# Altium project PR003.PrjPcb (part 8 of 11)

## Sheet LevelShifters_GPIOs.SchDoc
size A3; SheetNumber: 11; SheetTotal: 16
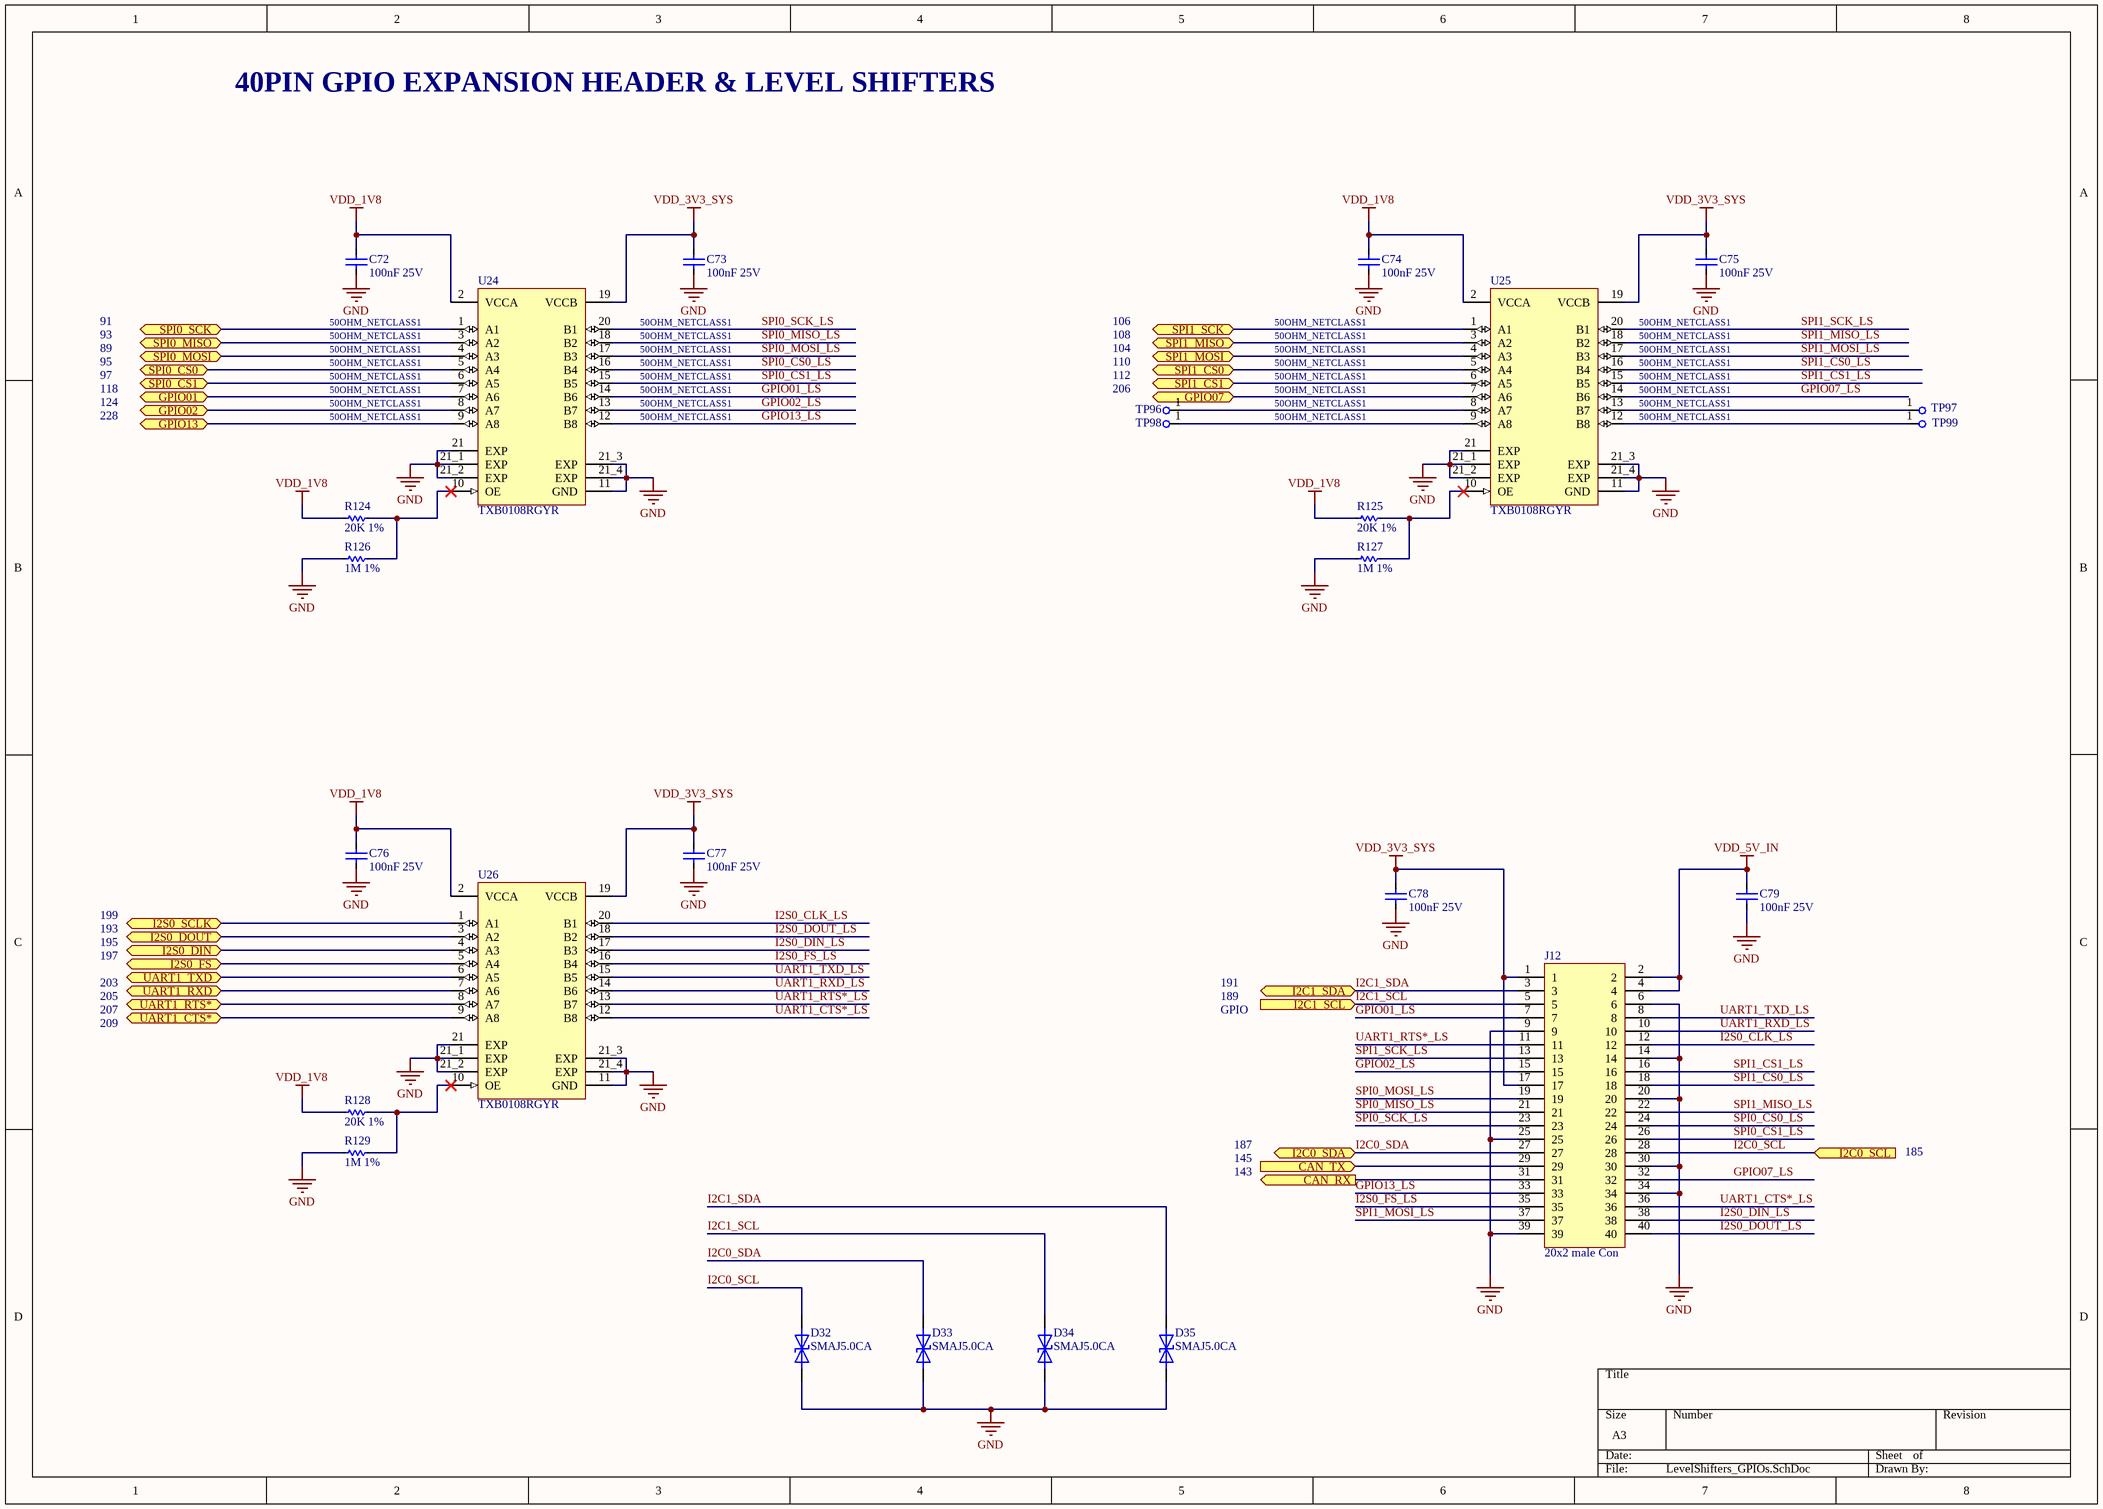
[diagram p10: LevelShifters_GPIOs.SchDoc]

### Parts
C72  100nF 25V  [C0402]
C73  100nF 25V  [C0402]
C74  100nF 25V  [C0402]
C75  100nF 25V  [C0402]
C76  100nF 25V  [C0402]
C77  100nF 25V  [C0402]
C78  100nF 25V  [C0402]
C79  100nF 25V  [C0402]
D32  SMAJ5.0CA  [DO-214AC]
D33  SMAJ5.0CA  [DO-214AC]
D34  SMAJ5.0CA  [DO-214AC]
D35  SMAJ5.0CA  [DO-214AC]
J12  20x2 male Con  [70246-4001]
R124  20K 1%  [R0402]
R125  20K 1%  [R0402]
R126  1M 1%  [R0402]
R127  1M 1%  [R0402]
R128  20K 1%  [R0402]
R129  1M 1%  [R0402]
TP96  (no value)  [TestPoint_Pad_D1.0mm]
TP97  TestPoint  [TestPoint_Pad_D1.0mm]  (value not drawn)
TP98  TestPoint  [TestPoint_Pad_D1.0mm]  (value not drawn)
TP99  TestPoint  [TestPoint_Pad_D1.0mm]  (value not drawn)
U24  TXB0108RGYR  [VQFN-20]
U25  TXB0108RGYR  [VQFN-20]
U26  TXB0108RGYR  [VQFN-20]

### Ports
CAN_RX (out), CAN_TX (in), GPIO01 (bidir), GPIO02 (bidir), GPIO07 (bidir), GPIO13 (bidir), I2C0_SCL (in), I2C0_SDA (bidir), I2C1_SCL (in), I2C1_SDA (bidir), I2S0_DIN (bidir), I2S0_DOUT (bidir), I2S0_FS (bidir), I2S0_SCLK (bidir), SPI0_CS0 (bidir), SPI0_CS1 (bidir), SPI0_MISO (bidir), SPI0_MOSI (bidir), SPI0_SCK (bidir), SPI1_CS0 (bidir), SPI1_CS1 (bidir), SPI1_MISO (bidir), SPI1_MOSI (bidir), SPI1_SCK (bidir), UART1_CTS* (bidir), UART1_RTS* (bidir), UART1_RXD (bidir), UART1_TXD (bidir)

### Nets
GND: C72.1 C73.1 C74.1 C75.1 C76.1 C77.1 C78.1 C79.1 D32.C D33.C D34.C D35.C J12.6 J12.9 J12.14 J12.20 J12.25 J12.30 J12.34 J12.39 R126.1 R127.1 R129.1 U24.11(GND) U24.21(EXP) U24.21_1(EXP) U24.21_2(EXP) U24.21_3(EXP) U24.21_4(EXP) U25.11(GND) U25.21(EXP) U25.21_1(EXP) U25.21_2(EXP) U25.21_3(EXP) U25.21_4(EXP) U26.11(GND) U26.21(EXP) U26.21_1(EXP) U26.21_2(EXP) U26.21_3(EXP) U26.21_4(EXP)
VDD_1V8: C72.2 C74.2 C76.2 R124.1 R125.1 R128.1 U24.2(VCCA) U25.2(VCCA) U26.2(VCCA)
VDD_3V3_SYS: C73.2 C75.2 C77.2 C78.2 J12.1 J12.17 U24.19(VCCB) U25.19(VCCB) U26.19(VCCB)
VDD_5V_IN: C79.2 J12.2 J12.4
GPIO01_LS: J12.7 U24.14(B6)
GPIO02_LS: J12.15 U24.13(B7)
GPIO07_LS: J12.32 U25.14(B6)
GPIO13_LS: J12.33 U24.12(B8)
I2C0_SCL: D32.A J12.28 ; port I2C0_SCL
I2C0_SDA: D33.A J12.27 ; port I2C0_SDA
I2C1_SCL: D34.A J12.5 ; port I2C1_SCL
I2C1_SDA: D35.A J12.3 ; port I2C1_SDA
I2S0_CLK_LS: J12.12 U26.20(B1)
I2S0_DIN_LS: J12.38 U26.17(B3)
I2S0_DOUT_LS: J12.40 U26.18(B2)
I2S0_FS_LS: J12.35 U26.16(B4)
SPI0_CS0_LS: J12.24 U24.16(B4)
SPI0_CS1_LS: J12.26 U24.15(B5)
SPI0_MISO_LS: J12.21 U24.18(B2)
SPI0_MOSI_LS: J12.19 U24.17(B3)
SPI0_SCK_LS: J12.23 U24.20(B1)
SPI1_CS0_LS: J12.18 U25.16(B4)
SPI1_CS1_LS: J12.16 U25.15(B5)
SPI1_MISO_LS: J12.22 U25.18(B2)
SPI1_MOSI_LS: J12.37 U25.17(B3)
SPI1_SCK_LS: J12.13 U25.20(B1)
UART1_CTS*_LS: J12.36 U26.12(B8)
UART1_RTS*_LS: J12.11 U26.13(B7)
UART1_RXD_LS: J12.10 U26.14(B6)
UART1_TXD_LS: J12.8 U26.15(B5)
NetJ10_89: U24.4(A3) ; port SPI0_MOSI
NetJ10_91: U24.1(A1) ; port SPI0_SCK
NetJ10_93: U24.3(A2) ; port SPI0_MISO
NetJ10_95: U24.5(A4) ; port SPI0_CS0
NetJ10_97: U24.6(A5) ; port SPI0_CS1
NetJ10_104: U25.4(A3) ; port SPI1_MOSI
NetJ10_106: U25.1(A1) ; port SPI1_SCK
NetJ10_108: U25.3(A2) ; port SPI1_MISO
NetJ10_110: U25.5(A4) ; port SPI1_CS0
NetJ10_112: U25.6(A5) ; port SPI1_CS1
NetJ10_118: U24.7(A6) ; port GPIO01
NetJ10_124: U24.8(A7) ; port GPIO02
NetJ10_143: J12.31 ; port CAN_RX
NetJ10_145: J12.29 ; port CAN_TX
NetJ10_193: U26.3(A2) ; port I2S0_DOUT
NetJ10_195: U26.4(A3) ; port I2S0_DIN
NetJ10_197: U26.5(A4) ; port I2S0_FS
NetJ10_199: U26.1(A1) ; port I2S0_SCLK
NetJ10_203: U26.6(A5) ; port UART1_TXD
NetJ10_205: U26.7(A6) ; port UART1_RXD
NetJ10_206: U25.7(A6) ; port GPIO07
NetJ10_207: U26.8(A7) ; port UART1_RTS*
NetJ10_209: U26.9(A8) ; port UART1_CTS*
NetJ10_228: U24.9(A8) ; port GPIO13
NetR124_2: R124.2 R126.2 U24.10(OE)
NetR125_2: R125.2 R127.2 U25.10(OE)
NetR128_2: R128.2 R129.2 U26.10(OE)
NetTP96_1: TP96.1 U25.8(A7)
NetTP97_1: TP97.1 U25.13(B7)
NetTP98_1: TP98.1 U25.9(A8)
NetTP99_1: TP99.1 U25.12(B8)

### Notes on the sheet
- 40PIN GPIO EXPANSION HEADER & LEVEL SHIFTERS
- 91
- 93
- 89
- 95
- 97
- 50OHM_NETCLASS1
- 106
- 108
- 104
- 110
- 112
- (near U25) 50OHM_NETCLASS1
- 118
- 124
- 228
- 206
- 199
- 203
- 193
- 195
- 197
- 191
- 205
- 207
- 209
- 189
- GPIO
- 187
- 145
- 143
- 185

### Library data of the parts
C72-C79 = TMK105BJ104KV-F: as C39 on sheet HDMI_Connector; Supplier 1: Digi-Key; Manufacturer Part Number: TMK105BJ104KV-F; RoHS: Yes; Category: Ceramic Capacitors; Stock 1: 11997960; Pricing 1: 1=0.10000, 10=0.03700, 50=0.02000, 100=0.01630, 500=0.01166, 1000=0.00917, 2500=0.00833, 5000=0.00767 (USD); Mount: Surface Mount; Case/Package: 0402; Number of Pins: 2; Case Code (Imperial): 0402; Case Code (Metric): 1005; Weight: 2.3E-05oz; Min Operating Temperature: -55°C; Max Operating Temperature: 85°C; Capacitance: 100nF; Packaging: Tape and Reel; Dielectric: X5R; Voltage Rating (DC): 25V; Voltage Rating: 25V; Package Quantity: 1; Termination: SMD/SMT; Resistor Type: Ceramic; Voltage: 25V; Series: M; Construction: Flat; Length: 1mm; Width: 0.02inch; Height: 0.5mm; Depth: 0.5mm; Thickness: 0.022inch; Reach SVHC Compliant: Yes; Lead Free: Lead Free; Halogen Free: Halogen Free; RoHS Compliant: Yes; Supplier Part Number 1: 587-1456-1-ND
D32-D35 = SMAJ5.0CA: as D11 on sheet HDMI_Connector; Supplier 1: Digi-Key; Manufacturer Part Number: SMAJ5.0CA; RoHS: Yes; Category: TVS Diodes; Stock 1: 526420; Pricing 1: 1=0.43000, 10=0.32000, 100=0.19950, 500=0.13650, 1000=0.10500, 2000=0.09450 (USD); Mount: Surface Mount; Case/Package: DO-214AC; Number of Pins: 2; Min Operating Temperature: -65°C; Max Operating Temperature: 150°C; Package Quantity: 5000; Direction: Bidirectional; Packaging: Tape and Reel; Number of Bidirectional Channels: 1; Reverse Standoff Voltage: 5V; Min Breakdown Voltage: 6.4V; Breakdown Voltage: 6.4V; Number of Channels: 1; Polarity: Bidirectional; Termination: SMD/SMT; Peak Pulse Current: 43.5A; Power Dissipation: 400W; Voltage Rating (DC): 5V; Max Output Current: 43.5A; Resistor Type: Zener; Series: SMAJ; Clamping Voltage-Max: 9.2V; Length: 4.5mm; Width: 2.79mm; Height: 2.087mm; Radiation Hardening: No; Reach SVHC Compliant: Yes; Lead Free: Lead Free; RoHS Compliant: Yes; ComponentLink1URL: https://datasheet.ciiva.com/25624/0900766b810f4edb-25624837.pdf?src-supplier=Rs; ComponentLink1Description: https://datasheet.ciiva.com/25624/0900766b810f4edb-25624837.pdf?src-supplier=Rs; ComponentLink2URL: https://datasheet.ciiva.com/28473/607617-28473438.pdf?src-supplier=Element14; ComponentLink2Description: https://datasheet.ciiva.com/28473/607617-28473438.pdf?src-supplier=Element14; ComponentLink3URL: https://datasheet.ciiva.com/16206/littelfuse-tvs-diode-smaj-16206104.pdf?src-supplier=Future+Electronics; ComponentLink3Description: https://datasheet.ciiva.com/16206/littelfuse-tvs-diode-smaj-16206104.pdf?src-supplier=Future+Electronics; ComponentLink4URL: https://datasheet.ciiva.com/331/littelfuse-tvs-diode-smaj-datasheet-pdf-331055.pdf?src-supplier=Digi-Key; ComponentLink4Description: https://datasheet.ciiva.com/331/littelfuse-tvs-diode-smaj-datasheet-pdf-331055.pdf?src-supplier=Digi-Key; ComponentLink5URL: https://datasheet.ciiva.com/331/littelfuse-tvs-diode-smaj-datasheet-pdf-331056.pdf?src-supplier=Digi-Key; ComponentLink5Description: https://datasheet.ciiva.com/331/littelfuse-tvs-diode-smaj-datasheet-pdf-331056.pdf?src-supplier=Digi-Key; ComponentLink6URL: https://datasheet.ciiva.com/331/littelfuse-tvs-diode-smaj-datasheet-pdf-331054.pdf?src-supplier=Digi-Key; ComponentLink6Description: https://datasheet.ciiva.com/331/littelfuse-tvs-diode-smaj-datasheet-pdf-331054.pdf?src-supplier=Digi-Key; Supplier Part Number 1: SMAJ5.0CALFCT-ND
J12 = 0702464001: Conn Shrouded Header (4 Sides) HDR 40 POS 2.54mm Solder ST Thru-Hole C-Grid® Frame; Manufacturer: Molex; Supplier 1: Digi-Key; Manufacturer Part Number: 0702464001; RoHS: Yes; Category: Uncategorized; Stock 1: 9741; Pricing 1: 1=4.29000, 10=3.77400, 400=3.00210, 1200=2.48745 (USD); ComponentLink1URL: https://datasheet.ciiva.com/6814/702461001-sd-6814000.pdf?src-supplier=Digi-Key; ComponentLink1Description: https://datasheet.ciiva.com/6814/702461001-sd-6814000.pdf?src-supplier=Digi-Key; Supplier Part Number 1: WM6550-ND
R124 R125 R128 = AC0402FR-0720KL: Res Thick Film 0402 20K Ohm 1% 0.063W(1/16W) ±100ppm/C Pad SMD Automotive T/R; Manufacturer: Yageo; Power Rating: 62.5mW; Resistance: 20kR; Voltage Rating: 50V; Max Power Dissipation: 63mW; Temperature Coefficient: 100ppm/°C; Supplier 1: Digi-Key; Manufacturer Part Number: AC0402FR-0720KL; RoHS: Yes; Category: Chip SMD Resistors; Stock 1: 682198; Pricing 1: 1=0.10000, 10=0.01900, 100=0.00790, 1000=0.00353, 2500=0.00307, 5000=0.00253 (USD); Case/Package: 0402; Case Code (Imperial): 0402; Case Code (Metric): 1005; Min Operating Temperature: -55°C; Max Operating Temperature: 155°C; Packaging: Tape and Reel; Tolerance: 1%; Resistor Type: Thick Film; Number of Terminations: 2; Termination: SMD/SMT; Features: Moisture Resistant,Automotive AEC-Q200; Series: AC; Length: 0.039inch; Width: 0.02inch; Height: 0.015inch; RoHS Compliant: Yes; ComponentLink1URL: http://www.mouser.com/ds/2/447/yageodocoutput-1111992.pdf?src-supplier=Mouser; ComponentLink1Description: http://www.mouser.com/ds/2/447/yageodocoutput-1111992.pdf?src-supplier=Mouser; ComponentLink2URL: http://www.yageo.com/NewPortal/yageodocoutput?fileName=/pdf/R-Chip/PYu-AC_51_RoHS_L_6.pdf&src-supplier=Digi-Key; ComponentLink2Description: http://www.yageo.com/NewPortal/yageodocoutput?fileName=/pdf/R-Chip/PYu-AC_51_RoHS_L_6.pdf&src-supplier=Digi-Key; Supplier Part Number 1: YAG3454CT-ND
R126 R127 R129 = AC0402FR-071ML: as R102 on sheet Audio_CodeC; Supplier 1: Digi-Key; Manufacturer Part Number: AC0402FR-071ML; RoHS: Yes; Category: Chip SMD Resistors; Stock 1: 684587; Pricing 1: 1=0.10000, 10=0.01900, 100=0.00790, 1000=0.00353, 2500=0.00307, 5000=0.00253 (USD); Case/Package: 0402; Case Code (Imperial): 0402; Case Code (Metric): 1005; Size Code: 0402; Min Operating Temperature: -55°C; Max Operating Temperature: 155°C; Packaging: Tape and Reel; Tolerance: 1%; Termination: SMD/SMT; Resistor Type: Thick Film; Number of Terminations: 2; Features: Moisture Resistant,Automotive AEC-Q200; Series: AC; Construction: Rectangular; Length: 1mm; Width: 0.5mm; Height: 0.015inch; Depth: 0.5mm; Military Standard: Not; Lead Free: Lead Free; RoHS Compliant: Yes; ComponentLink1URL: http://www.yageo.com/documents/recent/PYu-AC_51_RoHS_L_2.pdf?src-supplier=Mouser; ComponentLink1Description: http://www.yageo.com/documents/recent/PYu-AC_51_RoHS_L_2.pdf?src-supplier=Mouser; ComponentLink2URL: http://www.yageo.com/documents/recent/PYu-AC_51_RoHS_L_2_revised.pdf?src-supplier=Future+Electronics; ComponentLink2Description: http://www.yageo.com/documents/recent/PYu-AC_51_RoHS_L_2_revised.pdf?src-supplier=Future+Electronics; ComponentLink3URL: http://www.yageo.com/NewPortal/yageodocoutput?fileName=/pdf/R-Chip/PYu-AC_51_RoHS_L_6.pdf&src-supplier=Digi-Key; ComponentLink3Description: http://www.yageo.com/NewPortal/yageodocoutput?fileName=/pdf/R-Chip/PYu-AC_51_RoHS_L_6.pdf&src-supplier=Digi-Key; Supplier Part Number 1: YAG3450CT-ND
TP96-TP99 = TestPoint_D1mm
U24-U26 = TXB0108RGYR: IC 8-BIT TRNSLTR 15KV ESD 20VQFN; Manufacturer: Texas Instruments; Data Rate: 100Mbps; Number of Channels: 8; Propagation Delay: 9.5ns; Max Supply Voltage: 5.5V; Min Supply Voltage: 1.2V; Logic Function: Translator; Turn-On Delay Time: 35.6ns; Low Level Output Current: 20uA; High Level Output Current: -20uA; Quiescent Current: 3.5uA; Output Type: 3-STATE; Rise Time: 0.8ns; Nominal Supply Current: 10uA; Channel Type: Bidirectional; Number of Circuits: 1; Supplier 1: Mouser; Manufacturer Part Number: TXB0108RGYR; RoHS: Yes; Category: Voltage Level Shifters; Stock 1: 23719; Pricing 1: 1=1.63000, 10=1.46000, 50=1.38000, 100=1.18000, 1000=0.80200, 10000=0.80100 (USD); Mount: Surface Mount; Case/Package: VQFN EP; Number of Pins: 20; Weight: 0.001517oz; Contact Plating: Gold; Min Operating Temperature: -40°C; Max Operating Temperature: 85°C; Package Quantity: 3000; Packaging: Tape and Reel; Number of Bits: 8; Output Current: 20uA; Series: -; Number of Inputs: 8; Termination: SMD/SMT; Supply Current: 10uA; Length: 4.5mm; Width: 3.5mm; Height: 0.8mm; Radiation Hardening: No; Lead Free: Lead Free; RoHS Compliant: Yes; Reach SVHC Compliant: Yes; ComponentLink1URL: https://datasheet.ciiva.com/15096/getdatasheetpartid-172984-15096214.pdf?src-supplier=Verical; ComponentLink1Description: https://datasheet.ciiva.com/15096/getdatasheetpartid-172984-15096214.pdf?src-supplier=Verical; ComponentLink2URL: https://datasheet.ciiva.com/1508/1811182-1508728.pdf?src-supplier=Element14; ComponentLink2Description: https://datasheet.ciiva.com/1508/1811182-1508728.pdf?src-supplier=Element14; ComponentLink3URL: https://datasheet.ciiva.com/1899/txb0108-1899602.pdf?src-supplier=Digi-Key; ComponentLink3Description: https://datasheet.ciiva.com/1899/txb0108-1899602.pdf?src-supplier=Digi-Key; ComponentLink4URL: https://datasheet.ciiva.com/1899/txb0108-1899601.pdf?src-supplier=Digi-Key; ComponentLink4Description: https://datasheet.ciiva.com/1899/txb0108-1899601.pdf?src-supplier=Digi-Key; ComponentLink5URL: https://datasheet.ciiva.com/1899/txb0108-1899603.pdf?src-supplier=Digi-Key; ComponentLink5Description: https://datasheet.ciiva.com/1899/txb0108-1899603.pdf?src-supplier=Digi-Key; Supplier Part Number 1: 595-TXB0108RGYR

## Sheet SoC_Fan_Header.SchDoc
size A3; SheetNumber: 14; SheetTotal: 16
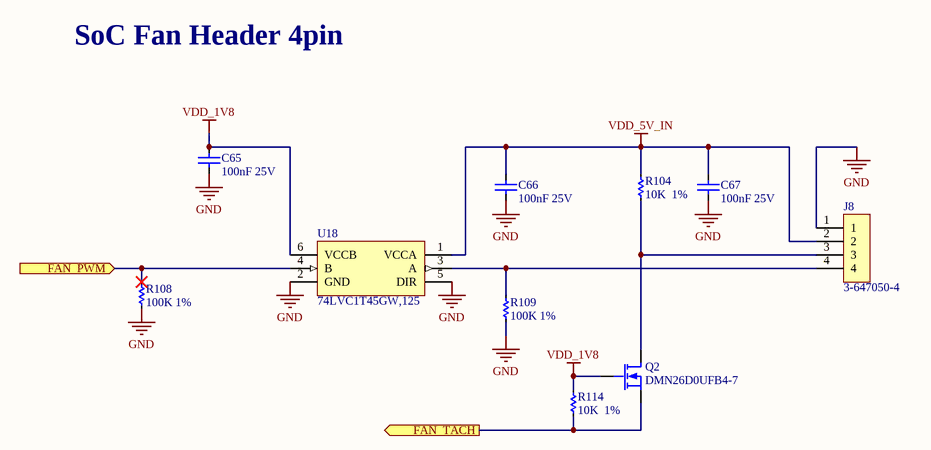
[diagram p11: SoC_Fan_Header.SchDoc]

### Parts
C65  100nF 25V  [C0402]
C66  100nF 25V  [C0402]
C67  100nF 25V  [C0402]
J8  3-647050-4  [3-647050-4]
Q2  DMN26D0UFB4-7  [DFN1006-3]
R104  10K  1%  [R0402]
R108  100K 1%  [R0402]
R109  100K 1%  [R0402]
R114  10K  1%  [R0402]
U18  74LVC1T45GW,125  [SOT-363]

### Ports
FAN_PWM (in), FAN_TACH (out)

### Nets
GND: C65.1 C66.1 C67.1 J8.1 R108.1 R109.1 U18.2(GND) U18.5(DIR)
VDD_1V8: C65.2 Q2.1(G) R114.2 U18.6(VCCB)
VDD_5V_IN: C66.2 C67.2 J8.2 R104.2 U18.1(VCCA)
NetJ8_3: J8.3 Q2.3(D) R104.1
NetJ8_4: J8.4 R109.2 U18.3(A)
NetJ10_208: Q2.2(S) R114.1 ; port FAN_TACH
NetJ10_230: R108.2 U18.4(B) ; port FAN_PWM

### Notes on the sheet
- SoC Fan Header 4pin

### Library data of the parts
C65-C67 = TMK105BJ104KV-F: as C39 on sheet HDMI_Connector; Supplier 1: Digi-Key; Manufacturer Part Number: TMK105BJ104KV-F; RoHS: Yes; Category: Ceramic Capacitors; Stock 1: 11997960; Pricing 1: 1=0.10000, 10=0.03700, 50=0.02000, 100=0.01630, 500=0.01166, 1000=0.00917, 2500=0.00833, 5000=0.00767 (USD); Mount: Surface Mount; Case/Package: 0402; Number of Pins: 2; Case Code (Imperial): 0402; Case Code (Metric): 1005; Weight: 2.3E-05oz; Min Operating Temperature: -55°C; Max Operating Temperature: 85°C; Capacitance: 100nF; Packaging: Tape and Reel; Dielectric: X5R; Voltage Rating (DC): 25V; Voltage Rating: 25V; Package Quantity: 1; Termination: SMD/SMT; Resistor Type: Ceramic; Voltage: 25V; Series: M; Construction: Flat; Length: 1mm; Width: 0.02inch; Height: 0.5mm; Depth: 0.5mm; Thickness: 0.022inch; Reach SVHC Compliant: Yes; Lead Free: Lead Free; Halogen Free: Halogen Free; RoHS Compliant: Yes; Supplier Part Number 1: 587-1456-1-ND
J8 = 3-647050-4: Header Assembly 4 Position MTA100 F/L HITEMP MTA-100 Series; Manufacturer: TE Connectivity; Supplier 1: Digi-Key; Manufacturer Part Number: 3-647050-4; RoHS: Yes; Category: Uncategorized; Stock 1: 12221; Pricing 1: 1=2.60000, 10=2.26400, 100=2.02290, 500=1.68574, 1000=1.44492, 5000=1.28116 (USD); ComponentLink1URL: https://datasheet.ciiva.com/717/eng-cd-647050-t-647050-c-drw-717307.pdf?src-supplier=Digi-Key; ComponentLink1Description: https://datasheet.ciiva.com/717/eng-cd-647050-t-647050-c-drw-717307.pdf?src-supplier=Digi-Key; ComponentLink2URL: https://datasheet.ciiva.com/30190/8852eng-ds-82056-mta-0608-30190425.pdf?src-supplier=Onlinecomponents.com; ComponentLink2Description: https://datasheet.ciiva.com/30190/8852eng-ds-82056-mta-0608-30190425.pdf?src-supplier=Onlinecomponents.com; Supplier Part Number 1: A122444-ND
Q2 = DMN26D0UFB4-7: as Q4 on sheet HDMI_Connector; Supplier 1: Mouser; Manufacturer Part Number: DMN26D0UFB4-7; RoHS: Yes; Category: MOSFETs; Stock 1: 21043; Pricing 1: 1=0.38000, 10=0.32100, 50=0.32100, 100=0.17000, 1000=0.07700, 10000=0.05000 (USD); Mount: Surface Mount; Case/Package: DFN; Number of Pins: 3; Min Operating Temperature: -55°C; Max Operating Temperature: 150°C; Packaging: Tape and Reel; Package Quantity: 3000; Max Power Dissipation: 350mW; Element Configuration: Single; Number of Channels: 1; Polarity: N-CHANNEL; Series: -; Drain-source On Resistance-Max: 10R; Length: 1.05mm; Width: 0.65mm; Height: 0.35mm; Radiation Hardening: No; Reach SVHC Compliant: Yes; Lead Free: Lead Free; RoHS Compliant: Yes; ComponentLink1URL: https://datasheet.ciiva.com/4443/ds31775-89139-4443083.pdf?src-supplier=Mouser; ComponentLink1Description: https://datasheet.ciiva.com/4443/ds31775-89139-4443083.pdf?src-supplier=Mouser; ComponentLink2URL: https://datasheet.ciiva.com/11176/ds31775-11176556.pdf?src-supplier=Avnet; ComponentLink2Description: https://datasheet.ciiva.com/11176/ds31775-11176556.pdf?src-supplier=Avnet; ComponentLink3URL: https://datasheet.ciiva.com/16434/ds31775-16434037.pdf?src-supplier=Future+Electronics; ComponentLink3Description: https://datasheet.ciiva.com/16434/ds31775-16434037.pdf?src-supplier=Future+Electronics; ComponentLink4URL: https://datasheet.ciiva.com/48532/ds31775-48532486.pdf?src-supplier=Avnet; ComponentLink4Description: https://datasheet.ciiva.com/48532/ds31775-48532486.pdf?src-supplier=Avnet; ComponentLink5URL: https://datasheet.ciiva.com/934/ds31775-934573.pdf?src-supplier=Digi-Key; ComponentLink5Description: https://datasheet.ciiva.com/934/ds31775-934573.pdf?src-supplier=Digi-Key; ComponentLink6URL: https://datasheet.ciiva.com/934/ds31775-934574.pdf?src-supplier=Digi-Key; ComponentLink6Description: https://datasheet.ciiva.com/934/ds31775-934574.pdf?src-supplier=Digi-Key; ComponentLink7URL: https://datasheet.ciiva.com/934/ds31775-934572.pdf?src-supplier=Digi-Key; ComponentLink7Description: https://datasheet.ciiva.com/934/ds31775-934572.pdf?src-supplier=Digi-Key; Supplier Part Number 1: 621-DMN26D0UFB4-7
R104 R114 = RC0402FR-0710KP: as R80 on sheet HDMI_Connector; Supplier 1: Digi-Key; Manufacturer Part Number: RC0402FR-0710KP; RoHS: Yes; Category: Chip SMD Resistors; Stock 1: 1032587; Pricing 1: 1=0.10000, 10=0.03100, 100=0.01280, 1000=0.00573, 2500=0.00497, 5000=0.00411 (USD); Case/Package: 0402; Case Code (Metric): 1005; Case Code (Imperial): 0402; Min Operating Temperature: -55°C; Max Operating Temperature: 155°C; Packaging: Tape and Reel; Resistor Type: Thick Film; Number of Terminations: 2; Tolerance: 1%; Features: Moisture Resistant; Length: 0.039inch; Width: 0.02inch; Height: 0.016inch; RoHS Compliant: Yes; ComponentLink1URL: http://www.yageo.com/NewPortal/yageodocoutput?fileName=/pdf/R-Chip/PYu-RC_51_RoHS_P_0.pdf&src-supplier=Digi-Key; ComponentLink1Description: http://www.yageo.com/NewPortal/yageodocoutput?fileName=/pdf/R-Chip/PYu-RC_51_RoHS_P_0.pdf&src-supplier=Digi-Key; Supplier Part Number 1: YAG1249CT-ND
R108 R109 = RC0402FR-07100KL: as R57 on sheet HDMI_Connector; Supplier 1: Digi-Key; Manufacturer Part Number: RC0402FR-07100KL; RoHS: Yes; Category: Chip SMD Resistors; Stock 1: 41082272; Pricing 1: 1=0.10000, 10=0.01400, 100=0.00580, 1000=0.00262, 2500=0.00228, 5000=0.00188 (USD); Case/Package: 0402; Case Code (Metric): 1005; Case Code (Imperial): 0402; Min Operating Temperature: -55°C; Max Operating Temperature: 155°C; Tolerance: 1%; Package Quantity: 1; Packaging: Tape and Reel; Resistor Type: Thick Film; Number of Terminations: 2; Termination: SMD/SMT; Max Power Dissipation: 63mW; Working Voltage: 50V; Features: Moisture Resistant; Series: RC; Resistance Tolerance: 1%; Construction: Rectangular; Technology: THICK FILM; Length: 0.039inch; Width: 0.02inch; Height: 0.016inch; Depth: 0.5mm; Reach SVHC Compliant: Yes; Military Standard: Not; Lead Free: Lead Free; RoHS Compliant: Yes; ComponentLink1URL: https://datasheet.ciiva.com/11819/0900766b80c66297-11819452.pdf?src-supplier=RSComponents; ComponentLink1Description: https://datasheet.ciiva.com/11819/0900766b80c66297-11819452.pdf?src-supplier=RSComponents; ComponentLink2URL: https://datasheet.ciiva.com/22747/1018594-22747509.pdf?src-supplier=Element14; ComponentLink2Description: https://datasheet.ciiva.com/22747/1018594-22747509.pdf?src-supplier=Element14; ComponentLink3URL: https://datasheet.ciiva.com/2453/pyu-r-int-thick-7-2453362.pdf?src-supplier=Digi-Key; ComponentLink3Description: https://datasheet.ciiva.com/2453/pyu-r-int-thick-7-2453362.pdf?src-supplier=Digi-Key; ComponentLink4URL: https://datasheet.ciiva.com/2453/pyu-r-int-thick-7-2453363.pdf?src-supplier=Digi-Key; ComponentLink4Description: https://datasheet.ciiva.com/2453/pyu-r-int-thick-7-2453363.pdf?src-supplier=Digi-Key; ComponentLink5URL: https://datasheet.ciiva.com/2453/pyu-r-int-thick-7-2453361.pdf?src-supplier=Digi-Key; ComponentLink5Description: https://datasheet.ciiva.com/2453/pyu-r-int-thick-7-2453361.pdf?src-supplier=Digi-Key; ComponentLink6URL: https://datasheet.ciiva.com/12667/pyu-rc0402-51-rohs-l-6-r-12667930.pdf?src-supplier=Mouser; ComponentLink6Description: https://datasheet.ciiva.com/12667/pyu-rc0402-51-rohs-l-6-r-12667930.pdf?src-supplier=Mouser; ComponentLink7URL: https://datasheet.ciiva.com/15189/getdatasheetpartid-323696-15189334.pdf?src-supplier=Verical; ComponentLink7Description: https://datasheet.ciiva.com/15189/getdatasheetpartid-323696-15189334.pdf?src-supplier=Verical; Supplier Part Number 1: 311-100KLRCT-ND
U18 = 74LVC1T45GW,125: TXRX XLATING DUAL 3ST 6TSSOP; Manufacturer: Nexperia; Supplier 1: Mouser; Manufacturer Part Number: 74LVC1T45GW,125; RoHS: Yes; Category: Voltage Level Shifters; Stock 1: 147483; Pricing 1: 1=0.47000, 10=0.37500, 50=0.37500, 100=0.27900, 1000=0.18200, 10000=0.15100 (USD); RoHS Compliant: Yes; ComponentLink1URL: http://www.farnell.com/datasheets/1645592.pdf?src-supplier=Farnell; ComponentLink1Description: http://www.farnell.com/datasheets/1645592.pdf?src-supplier=Farnell; ComponentLink2URL: https://assets.nexperia.com/documents/data-sheet/74LVC_LVCH1T45.pdf?src-supplier=Digi-Key; ComponentLink2Description: https://assets.nexperia.com/documents/data-sheet/74LVC_LVCH1T45.pdf?src-supplier=Digi-Key; Supplier Part Number 1: 771-74LVC1T45GW125

## Sheet Config_UART_OptionalHeader.SchDoc
size A3; SheetNumber: 12; SheetTotal: 16
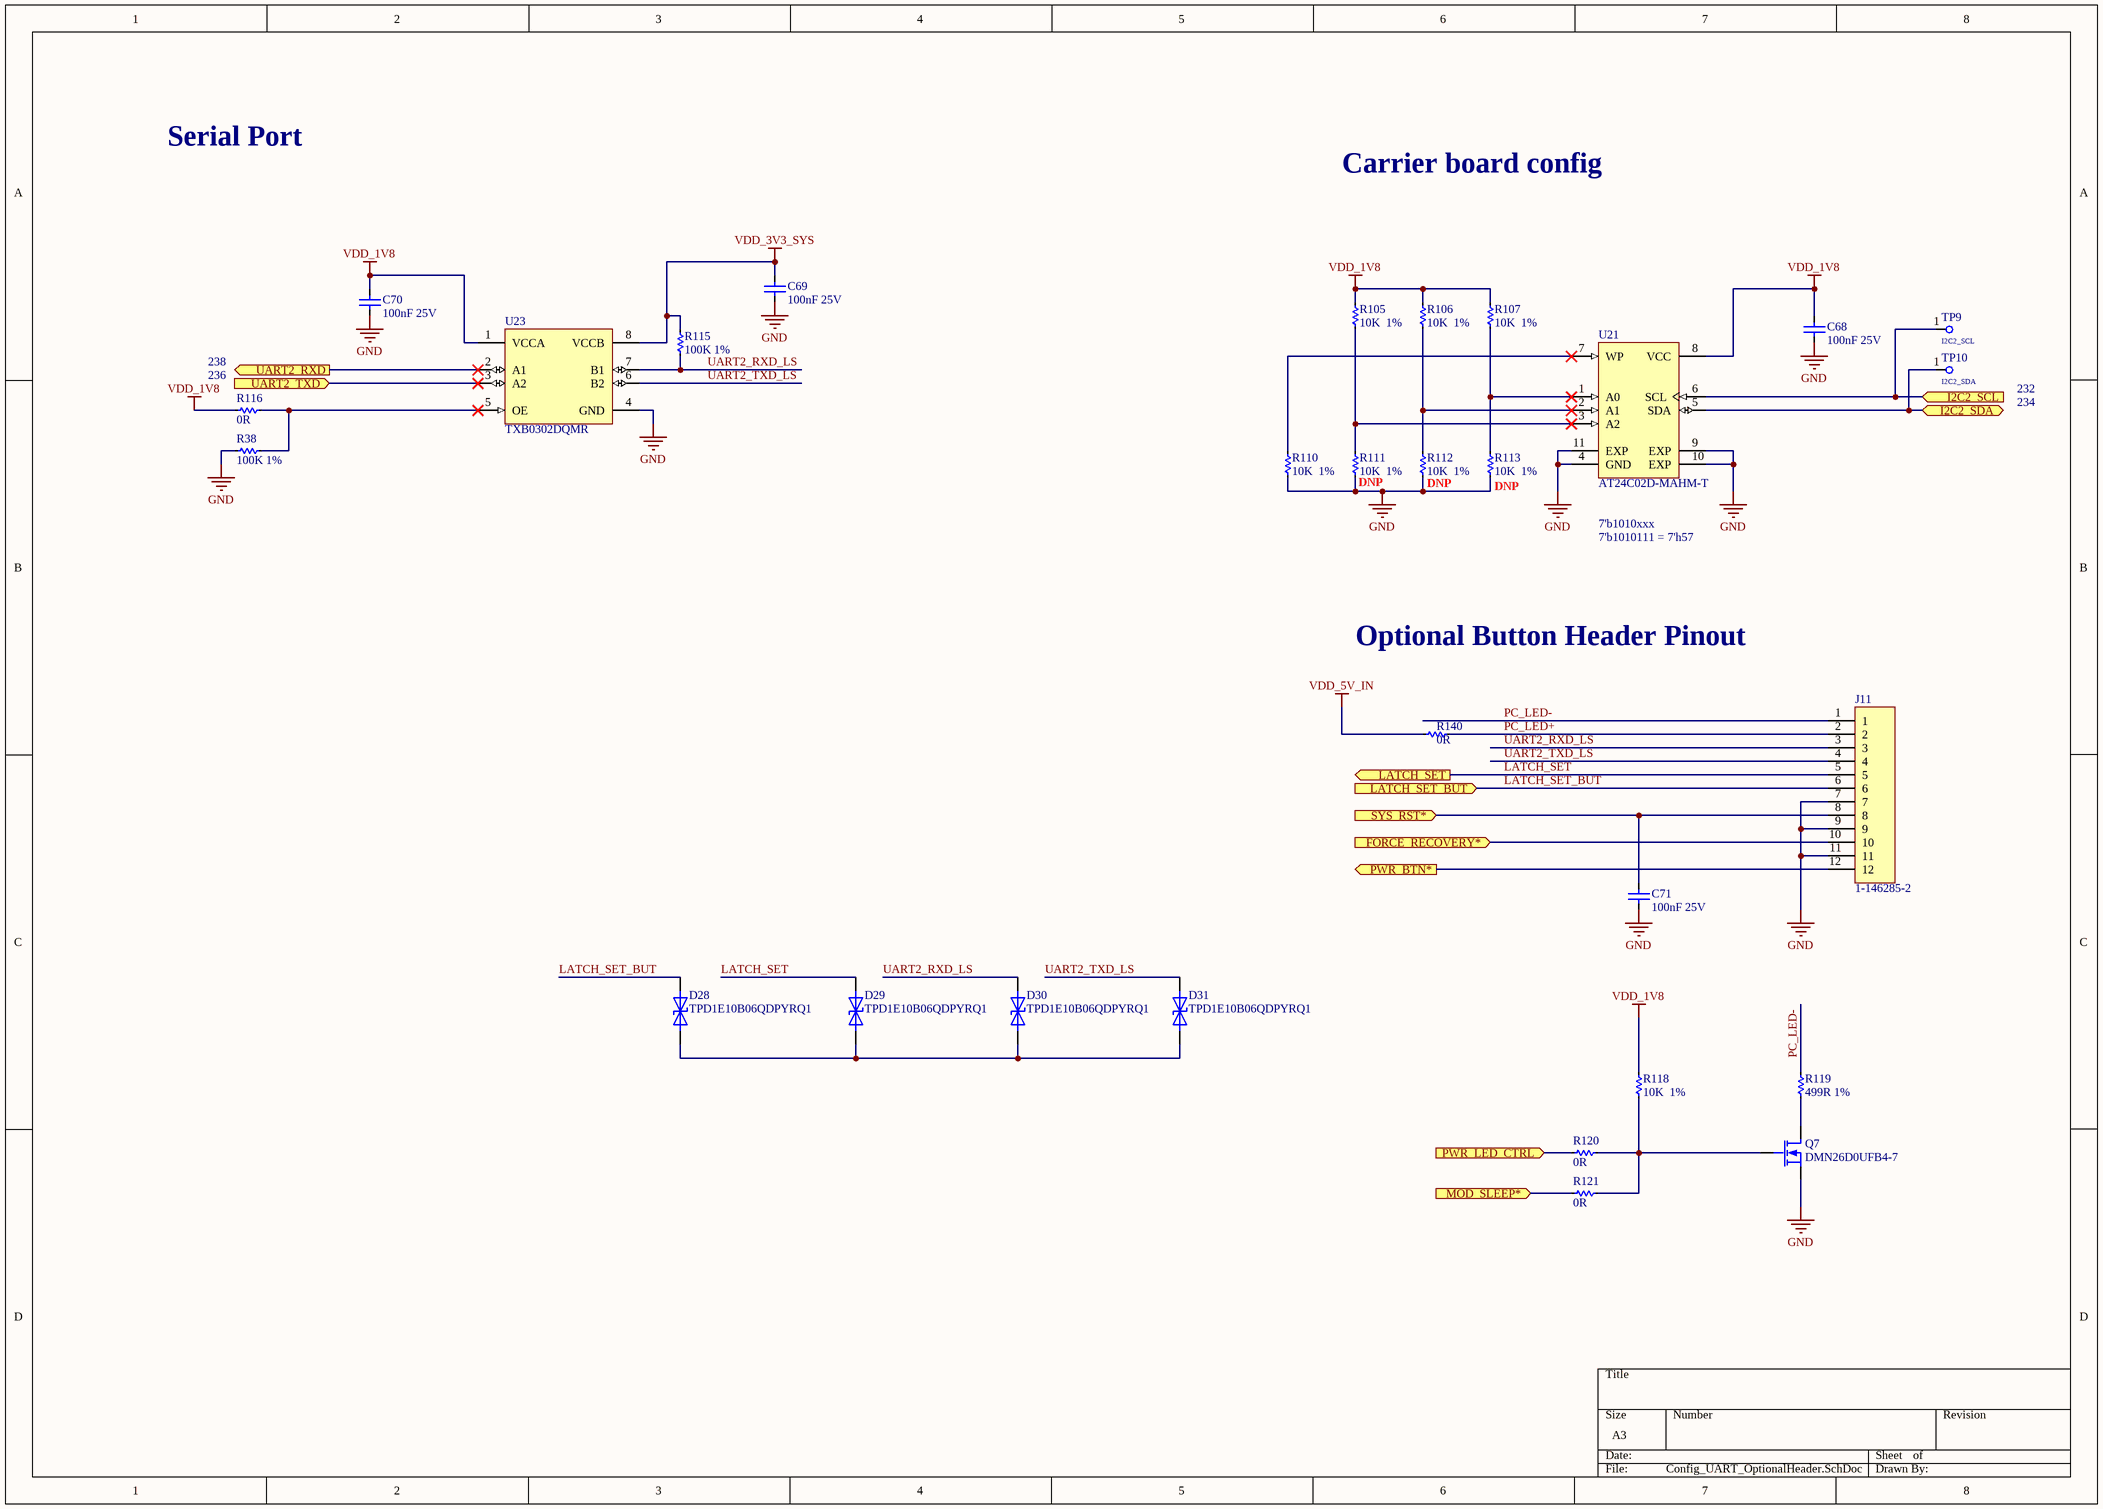
[diagram p12: Config_UART_OptionalHeader.SchDoc]

### Parts
C68  100nF 25V  [C0402]
C69  100nF 25V  [C0402]
C70  100nF 25V  [C0402]
C71  100nF 25V  [C0402]
D28  TPD1E10B06QDPYRQ1  [2-X1SON (1x.60)]
D29  TPD1E10B06QDPYRQ1  [2-X1SON (1x.60)]
D30  TPD1E10B06QDPYRQ1  [2-X1SON (1x.60)]
D31  TPD1E10B06QDPYRQ1  [2-X1SON (1x.60)]
J11  1-146285-2  [1-146285-2]
Q7  DMN26D0UFB4-7  [DFN1006-3]
R38  100K 1%  [R0402]
R105  10K  1%  [R0402]
R106  10K  1%  [R0402]
R107  10K  1%  [R0402]
R110  10K  1%  [R0402]
R111  10K  1%  [R0402]
R112  10K  1%  [R0402]
R113  10K  1%  [R0402]
R115  100K 1%  [R0402]
R116  0R  [R0402]
R118  10K  1%  [R0402]
R119  499R 1%  [R0402]
R120  0R  [R0402]
R121  0R  [R0402]
R140  0R  [R0603]
TP9  I2C2_SCL  [TestPoint_Pad_D1.0mm]
TP10  I2C2_SDA  [TestPoint_Pad_D1.0mm]
U21  AT24C02D-MAHM-T  [UDFN (2x3)-8]
U23  TXB0302DQMR  [8-X2SON (1.8x1.2)]

### Ports
FORCE_RECOVERY* (in), I2C2_SCL (in), I2C2_SDA (bidir), LATCH_SET (out), LATCH_SET_BUT (in), MOD_SLEEP* (in), PWR_BTN* (out), PWR_LED_CTRL (in), SYS_RST* (in), UART2_RXD (out), UART2_TXD (in)

### Nets
GND: C68.1 C69.1 C70.1 C71.1 J11.7 J11.9 J11.11 Q7.2(S) R38.1 R110.1 R111.1 R112.1 R113.1 U21.4(GND) U21.9(EXP) U21.10(EXP) U21.11(EXP) U23.4(GND)
VDD_1V8: C68.2 C70.2 R105.2 R106.2 R107.2 R116.1 R118.2 U21.8(VCC) U23.1(VCCA)
VDD_3V3_SYS: C69.2 R115.2 U23.8(VCCB)
VDD_5V_IN: R140.1
I2C2_SCL: TP9.1 U21.6(SCL) ; port I2C2_SCL
I2C2_SDA: TP10.1 U21.5(SDA) ; port I2C2_SDA
LATCH_SET: D29.2 J11.5 ; port LATCH_SET
LATCH_SET_BUT: D28.2 J11.6 ; port LATCH_SET_BUT
MOD_SLEEP*: R121.1 ; port MOD_SLEEP*
PC_LED+: J11.2 R140.2
PC_LED-: J11.1 R119.2
PWR_BTN*: J11.12 ; port PWR_BTN*
PWR_LED_CTRL: R120.1 ; port PWR_LED_CTRL
SYS_RST*: C71.2 J11.8 ; port SYS_RST*
UART2_RXD_LS: D30.2 J11.3 R115.1 U23.7(B1)
UART2_TXD_LS: D31.2 J11.4 U23.6(B2)
NetD28_1: D28.1 D29.1 D30.1 D31.1
NetD47_2: J11.10 ; port FORCE_RECOVERY*
NetJ10_236: U23.3(A2) ; port UART2_TXD
NetJ10_238: U23.2(A1) ; port UART2_RXD
NetQ7_1: Q7.1(G) R118.1 R120.2 R121.2
NetQ7_3: Q7.3(D) R119.1
NetR38_2: R38.2 R116.2 U23.5(OE)
NetR105_1: R105.1 R111.2 U21.3(A2)
NetR106_1: R106.1 R112.2 U21.2(A1)
NetR107_1: R107.1 R113.2 U21.1(A0)
NetR110_2: R110.2 U21.7(WP)

### Notes on the sheet
- Serial Port
- Carrier board config
- (near R116) 238
- (near R116) 236
- 232
- 234
- (near R111) DNP
- (near R112) DNP
- (near R113) DNP
- 7'b1010xxx
- 7'b1010111 = 7'h57
- Optional Button Header Pinout

### Library data of the parts
C68-C71 = TMK105BJ104KV-F: as C39 on sheet HDMI_Connector; Supplier 1: Digi-Key; Manufacturer Part Number: TMK105BJ104KV-F; RoHS: Yes; Category: Ceramic Capacitors; Stock 1: 11997960; Pricing 1: 1=0.10000, 10=0.03700, 50=0.02000, 100=0.01630, 500=0.01166, 1000=0.00917, 2500=0.00833, 5000=0.00767 (USD); Mount: Surface Mount; Case/Package: 0402; Number of Pins: 2; Case Code (Imperial): 0402; Case Code (Metric): 1005; Weight: 2.3E-05oz; Min Operating Temperature: -55°C; Max Operating Temperature: 85°C; Capacitance: 100nF; Packaging: Tape and Reel; Dielectric: X5R; Voltage Rating (DC): 25V; Voltage Rating: 25V; Package Quantity: 1; Termination: SMD/SMT; Resistor Type: Ceramic; Voltage: 25V; Series: M; Construction: Flat; Length: 1mm; Width: 0.02inch; Height: 0.5mm; Depth: 0.5mm; Thickness: 0.022inch; Reach SVHC Compliant: Yes; Lead Free: Lead Free; Halogen Free: Halogen Free; RoHS Compliant: Yes; Supplier Part Number 1: 587-1456-1-ND
D28-D31 = TPD1E10B06QDPYRQ1: as D9 on sheet HDMI_Connector; Supplier 1: Mouser; Manufacturer Part Number: TPD1E10B06QDPYRQ1; RoHS: Yes; Category: TVS Diodes; Stock 1: 130973; Pricing 1: 1=0.46000, 10=0.34900, 50=0.34900, 100=0.21800, 1000=0.11500, 10000=0.08800 (USD); Case/Package: 0402; Number of Pins: 2; Min Operating Temperature: -40°C; Max Operating Temperature: 125°C; Lead Free: Lead Free; RoHS Compliant: Yes; ComponentLink1URL: http://www.ti.com/lit/ds/symlink/tpd1e10b06-q1.pdf?src-supplier=Digi-Key; ComponentLink1Description: http://www.ti.com/lit/ds/symlink/tpd1e10b06-q1.pdf?src-supplier=Digi-Key; ComponentLink2URL: http://www.ti.com/general/docs/suppproductinfo.tsp?distId=10&amp;gotoUrl=http%3A%2F%2Fwww.ti.com%2Flit%2Fgpn%2Ftpd1e10b06-q1&src-supplier=Digi-Key; ComponentLink2Description: http://www.ti.com/general/docs/suppproductinfo.tsp?distId=10&amp;gotoUrl=http%3A%2F%2Fwww.ti.com%2Flit%2Fgpn%2Ftpd1e10b06-q1&src-supplier=Digi-Key; Supplier Part Number 1: 595-PD1E10B06QDPYRQ1
J11 = 1-146285-2: Conn Unshrouded Header HDR 12 POS 2.54mm Solder ST Thru-Hole Automotive Carton; Manufacturer: TE Connectivity; Supplier 1: Avnet; Manufacturer Part Number: 1-146285-2; RoHS: No; Category: Connectors; ComponentLink1URL: https://datasheet.ciiva.com/9518/eng-ds-1307819-ampmodu-0811-9518222.pdf?src-supplier=Avnet; ComponentLink1Description: https://datasheet.ciiva.com/9518/eng-ds-1307819-ampmodu-0811-9518222.pdf?src-supplier=Avnet; ComponentLink2URL: https://datasheet.ciiva.com/716/eng-cd-146285-h-716787.pdf?src-supplier=Digi-Key; ComponentLink2Description: https://datasheet.ciiva.com/716/eng-cd-146285-h-716787.pdf?src-supplier=Digi-Key; Supplier Part Number 1: 1-146285-2
Q7 = DMN26D0UFB4-7: as Q4 on sheet HDMI_Connector; Supplier 1: Mouser; Manufacturer Part Number: DMN26D0UFB4-7; RoHS: Yes; Category: MOSFETs; Stock 1: 21043; Pricing 1: 1=0.38000, 10=0.32100, 50=0.32100, 100=0.17000, 1000=0.07700, 10000=0.05000 (USD); Mount: Surface Mount; Case/Package: DFN; Number of Pins: 3; Min Operating Temperature: -55°C; Max Operating Temperature: 150°C; Packaging: Tape and Reel; Package Quantity: 3000; Max Power Dissipation: 350mW; Element Configuration: Single; Number of Channels: 1; Polarity: N-CHANNEL; Series: -; Drain-source On Resistance-Max: 10R; Length: 1.05mm; Width: 0.65mm; Height: 0.35mm; Radiation Hardening: No; Reach SVHC Compliant: Yes; Lead Free: Lead Free; RoHS Compliant: Yes; ComponentLink1URL: https://datasheet.ciiva.com/4443/ds31775-89139-4443083.pdf?src-supplier=Mouser; ComponentLink1Description: https://datasheet.ciiva.com/4443/ds31775-89139-4443083.pdf?src-supplier=Mouser; ComponentLink2URL: https://datasheet.ciiva.com/11176/ds31775-11176556.pdf?src-supplier=Avnet; ComponentLink2Description: https://datasheet.ciiva.com/11176/ds31775-11176556.pdf?src-supplier=Avnet; ComponentLink3URL: https://datasheet.ciiva.com/16434/ds31775-16434037.pdf?src-supplier=Future+Electronics; ComponentLink3Description: https://datasheet.ciiva.com/16434/ds31775-16434037.pdf?src-supplier=Future+Electronics; ComponentLink4URL: https://datasheet.ciiva.com/48532/ds31775-48532486.pdf?src-supplier=Avnet; ComponentLink4Description: https://datasheet.ciiva.com/48532/ds31775-48532486.pdf?src-supplier=Avnet; ComponentLink5URL: https://datasheet.ciiva.com/934/ds31775-934573.pdf?src-supplier=Digi-Key; ComponentLink5Description: https://datasheet.ciiva.com/934/ds31775-934573.pdf?src-supplier=Digi-Key; ComponentLink6URL: https://datasheet.ciiva.com/934/ds31775-934574.pdf?src-supplier=Digi-Key; ComponentLink6Description: https://datasheet.ciiva.com/934/ds31775-934574.pdf?src-supplier=Digi-Key; ComponentLink7URL: https://datasheet.ciiva.com/934/ds31775-934572.pdf?src-supplier=Digi-Key; ComponentLink7Description: https://datasheet.ciiva.com/934/ds31775-934572.pdf?src-supplier=Digi-Key; Supplier Part Number 1: 621-DMN26D0UFB4-7
R38 R115 = RC0402FR-07100KL: as R57 on sheet HDMI_Connector; Supplier 1: Digi-Key; Manufacturer Part Number: RC0402FR-07100KL; RoHS: Yes; Category: Chip SMD Resistors; Stock 1: 41082272; Pricing 1: 1=0.10000, 10=0.01400, 100=0.00580, 1000=0.00262, 2500=0.00228, 5000=0.00188 (USD); Case/Package: 0402; Case Code (Metric): 1005; Case Code (Imperial): 0402; Min Operating Temperature: -55°C; Max Operating Temperature: 155°C; Tolerance: 1%; Package Quantity: 1; Packaging: Tape and Reel; Resistor Type: Thick Film; Number of Terminations: 2; Termination: SMD/SMT; Max Power Dissipation: 63mW; Working Voltage: 50V; Features: Moisture Resistant; Series: RC; Resistance Tolerance: 1%; Construction: Rectangular; Technology: THICK FILM; Length: 0.039inch; Width: 0.02inch; Height: 0.016inch; Depth: 0.5mm; Reach SVHC Compliant: Yes; Military Standard: Not; Lead Free: Lead Free; RoHS Compliant: Yes; ComponentLink1URL: https://datasheet.ciiva.com/11819/0900766b80c66297-11819452.pdf?src-supplier=RSComponents; ComponentLink1Description: https://datasheet.ciiva.com/11819/0900766b80c66297-11819452.pdf?src-supplier=RSComponents; ComponentLink2URL: https://datasheet.ciiva.com/22747/1018594-22747509.pdf?src-supplier=Element14; ComponentLink2Description: https://datasheet.ciiva.com/22747/1018594-22747509.pdf?src-supplier=Element14; ComponentLink3URL: https://datasheet.ciiva.com/2453/pyu-r-int-thick-7-2453362.pdf?src-supplier=Digi-Key; ComponentLink3Description: https://datasheet.ciiva.com/2453/pyu-r-int-thick-7-2453362.pdf?src-supplier=Digi-Key; ComponentLink4URL: https://datasheet.ciiva.com/2453/pyu-r-int-thick-7-2453363.pdf?src-supplier=Digi-Key; ComponentLink4Description: https://datasheet.ciiva.com/2453/pyu-r-int-thick-7-2453363.pdf?src-supplier=Digi-Key; ComponentLink5URL: https://datasheet.ciiva.com/2453/pyu-r-int-thick-7-2453361.pdf?src-supplier=Digi-Key; ComponentLink5Description: https://datasheet.ciiva.com/2453/pyu-r-int-thick-7-2453361.pdf?src-supplier=Digi-Key; ComponentLink6URL: https://datasheet.ciiva.com/12667/pyu-rc0402-51-rohs-l-6-r-12667930.pdf?src-supplier=Mouser; ComponentLink6Description: https://datasheet.ciiva.com/12667/pyu-rc0402-51-rohs-l-6-r-12667930.pdf?src-supplier=Mouser; ComponentLink7URL: https://datasheet.ciiva.com/15189/getdatasheetpartid-323696-15189334.pdf?src-supplier=Verical; ComponentLink7Description: https://datasheet.ciiva.com/15189/getdatasheetpartid-323696-15189334.pdf?src-supplier=Verical; Supplier Part Number 1: 311-100KLRCT-ND
R105-R107 R110-R113 R118 = RC0402FR-0710KP: as R80 on sheet HDMI_Connector; Supplier 1: Digi-Key; Manufacturer Part Number: RC0402FR-0710KP; RoHS: Yes; Category: Chip SMD Resistors; Stock 1: 1032587; Pricing 1: 1=0.10000, 10=0.03100, 100=0.01280, 1000=0.00573, 2500=0.00497, 5000=0.00411 (USD); Case/Package: 0402; Case Code (Metric): 1005; Case Code (Imperial): 0402; Min Operating Temperature: -55°C; Max Operating Temperature: 155°C; Packaging: Tape and Reel; Resistor Type: Thick Film; Number of Terminations: 2; Tolerance: 1%; Features: Moisture Resistant; Length: 0.039inch; Width: 0.02inch; Height: 0.016inch; RoHS Compliant: Yes; ComponentLink1URL: http://www.yageo.com/NewPortal/yageodocoutput?fileName=/pdf/R-Chip/PYu-RC_51_RoHS_P_0.pdf&src-supplier=Digi-Key; ComponentLink1Description: http://www.yageo.com/NewPortal/yageodocoutput?fileName=/pdf/R-Chip/PYu-RC_51_RoHS_P_0.pdf&src-supplier=Digi-Key; Supplier Part Number 1: YAG1249CT-ND
R116 R120 R121 = RC0402FR-070RL: as R83 on sheet Audio_CodeC; Supplier 1: Digi-Key; Manufacturer Part Number: RC0402FR-070RL; RoHS: Yes; Category: Chip SMD Resistors; Stock 1: 8989202; Pricing 1: 1=0.10000, 10=0.01200, 25=0.00840, 50=0.00640, 100=0.00480, 250=0.00364, 500=0.00290, 1000=0.00214, 5000=0.00154 (USD); Mount: Surface Mount; Case/Package: 0402; Case Code (Imperial): 0402; Case Code (Metric): 1005; Contact Plating: Tin,Matte; Size Code: 0402; Min Operating Temperature: -55°C; Max Operating Temperature: 155°C; Resistance: 0R; Packaging: Tape and Reel; Resistor Type: Thick Film; Termination: SMD/SMT; Features: Moisture Resistant; Series: RC; Number of Terminations: 2; Length: 1mm; Width: 0.5mm; Height: 0.35mm; Radiation Hardening: No; Lead Free: Lead Free; RoHS Compliant: Yes; ComponentLink1URL: https://datasheet.ciiva.com/8896/pyu-rc0402-51-rohs-l-6-8896149.pdf?src-supplier=Avnet; ComponentLink1Description: https://datasheet.ciiva.com/8896/pyu-rc0402-51-rohs-l-6-8896149.pdf?src-supplier=Avnet; ComponentLink2URL: https://datasheet.ciiva.com/16790/pyu-rc0402-51-rohs-l-6-r-16790444.pdf?src-supplier=Future+Electronics; ComponentLink2Description: https://datasheet.ciiva.com/16790/pyu-rc0402-51-rohs-l-6-r-16790444.pdf?src-supplier=Future+Electronics; Supplier Part Number 1: 311-0.0LRCT-ND
R119 = RC0402FR-07499RL: as R68 on sheet HDMI_Connector; Supplier 1: Digi-Key; Manufacturer Part Number: RC0402FR-07499RL; RoHS: Yes; Category: Chip SMD Resistors; Stock 1: 3766935; Pricing 1: 1=0.10000, 10=0.01400, 100=0.00580, 1000=0.00262, 2500=0.00228, 5000=0.00188 (USD); Case/Package: 0402; Case Code (Metric): 1005; Case Code (Imperial): 0402; Size Code: 0402; Min Operating Temperature: -55°C; Max Operating Temperature: 155°C; Tolerance: 1%; Package Quantity: 1; Packaging: Tape and Reel; Features: Moisture Resistant; Resistance: 499R; Voltage Rating: 50V; Resistor Type: Thick Film; Number of Terminations: 2; Termination: SMD/SMT; Temperature Coefficient: 100ppm/°C; Series: RC; Resistance Tolerance: 1%; Construction: Rectangular; Length: 0.039inch; Width: 0.02inch; Height: 0.016inch; Depth: 0.5mm; Lead Free: Lead Free; Reach SVHC Compliant: Yes; Military Standard: Not; RoHS Compliant: Yes; ComponentLink1URL: https://datasheet.ciiva.com/2453/pyu-r-int-thick-7-2453539.pdf?src-supplier=Digi-Key; ComponentLink1Description: https://datasheet.ciiva.com/2453/pyu-r-int-thick-7-2453539.pdf?src-supplier=Digi-Key; ComponentLink2URL: https://datasheet.ciiva.com/2453/pyu-r-int-thick-7-2453540.pdf?src-supplier=Digi-Key; ComponentLink2Description: https://datasheet.ciiva.com/2453/pyu-r-int-thick-7-2453540.pdf?src-supplier=Digi-Key; ComponentLink3URL: https://datasheet.ciiva.com/2453/pyu-r-int-thick-7-2453538.pdf?src-supplier=Digi-Key; ComponentLink3Description: https://datasheet.ciiva.com/2453/pyu-r-int-thick-7-2453538.pdf?src-supplier=Digi-Key; Supplier Part Number 1: 311-499LRCT-ND
R140 = CR0603-J/-000ELF: as R172 on sheet Block_UART, I2C, CAN and GPIOs; Supplier 1: Digi-Key; Manufacturer Part Number: CR0603-J/-000ELF; RoHS: Yes; Category: Chip SMD Resistors; Stock 1: 1690954; Pricing 1: 1=0.10000, 10=0.01300, 25=0.00960, 50=0.00720, 100=0.00540, 250=0.00408, 500=0.00328, 1000=0.00241 (USD); Mount: Surface Mount; Case/Package: 0603; Number of Pins: 2; Case Code (Imperial): 0603; Case Code (Metric): 1608; Contact Plating: Tin; Min Operating Temperature: -55°C; Max Operating Temperature: 155°C; Packaging: Tape and Reel; Package Quantity: 5000; Resistor Type: Thick Film; Termination: SMD/SMT; Max Power Dissipation: 100mW; Voltage Rating (DC): 50V; Series: CR0603; Technology: THICK FILM; Construction: Rectangular; Features: Moisture Resistant; Number of Terminations: 2; Length: 1.6mm; Width: 0.8mm; Height: 0.45mm; Depth: 0.8mm; Thickness: 457um; Radiation Hardening: No; Reach SVHC Compliant: Yes; Military Standard: Not; RoHS Compliant: Yes; ComponentLink1URL: https://datasheet.ciiva.com/11809/0900766b80fcdb72-11809586.pdf?src-supplier=RSComponents; ComponentLink1Description: https://datasheet.ciiva.com/11809/0900766b80fcdb72-11809586.pdf?src-supplier=RSComponents; ComponentLink2URL: https://datasheet.ciiva.com/7001/1902866-7001645.pdf?src-supplier=Newark; ComponentLink2Description: https://datasheet.ciiva.com/7001/1902866-7001645.pdf?src-supplier=Newark; ComponentLink3URL: https://datasheet.ciiva.com/7986/691949-7986171.pdf?src-supplier=Element14; ComponentLink3Description: https://datasheet.ciiva.com/7986/691949-7986171.pdf?src-supplier=Element14; ComponentLink4URL: https://datasheet.ciiva.com/7660/1856384-7660956.pdf?src-supplier=Element14; ComponentLink4Description: https://datasheet.ciiva.com/7660/1856384-7660956.pdf?src-supplier=Element14; ComponentLink5URL: https://datasheet.ciiva.com/22693/1902866-22693213.pdf?src-supplier=Element14; ComponentLink5Description: https://datasheet.ciiva.com/22693/1902866-22693213.pdf?src-supplier=Element14; ComponentLink6URL: https://datasheet.ciiva.com/5545/chpreztr-5545708.pdf?src-supplier=Mouser; ComponentLink6Description: https://datasheet.ciiva.com/5545/chpreztr-5545708.pdf?src-supplier=Mouser; ComponentLink7URL: https://datasheet.ciiva.com/16761/70154685-16761515.pdf?src-supplier=Allied+Electronics; ComponentLink7Description: https://datasheet.ciiva.com/16761/70154685-16761515.pdf?src-supplier=Allied+Electronics; ComponentLink8URL: https://datasheet.ciiva.com/30062/159chpreztr-30062601.pdf?src-supplier=Onlinecomponents.com; ComponentLink8Description: https://datasheet.ciiva.com/30062/159chpreztr-30062601.pdf?src-supplier=Onlinecomponents.com; ComponentLink9URL: https://datasheet.ciiva.com/48692/001055497-da-01-en-smd-wid-cr0603-j-000elf-0-0-ohm-1-10w-48692135.pdf?src-supplier=Conrad; ComponentLink9Description: https://datasheet.ciiva.com/48692/001055497-da-01-en-smd-wid-cr0603-j-000elf-0-0-ohm-1-10w-48692135.pdf?src-supplier=Conrad; Supplier Part Number 1: CR0603-J/-000ELFCT-ND
TP9 TP10 = TestPoint_D1mm
U21 = AT24C02D-MAHM-T: EEPROM Serial-2Wire 2K-bit 256 x 8 1.8V/2.5V/3.3V 8-Pin UDFN EP T/R; Manufacturer: Microchip; Interface: I2C,Serial,2-Wire; Access Time: 900ns; Density: 2Kb; Frequency: 1MHz; Max Supply Voltage: 3.6V; Min Supply Voltage: 1.7V; Supplier 1: Mouser; Manufacturer Part Number: AT24C02D-MAHM-T; RoHS: Yes; Category: Uncategorized; Pricing 1: 1=0.28000, 10=0.28000, 50=0.28000, 100=0.28000, 1000=0.28000, 10000=0.28000 (USD); Mount: Surface Mount; Number of Pins: 8; Contact Plating: Gold; Min Operating Temperature: -40°C; Max Operating Temperature: 85°C; Package Quantity: 5000; Packaging: Tape and Reel; Memory Type: EEPROM; Max Frequency: 1MHz; RoHS Compliant: Yes; ComponentLink1URL: https://datasheet.ciiva.com/48496/atmel-8871-seeprom-at24c01d-02d-datasheet-48496454.pdf?src-supplier=Avnet; ComponentLink1Description: https://datasheet.ciiva.com/48496/atmel-8871-seeprom-at24c01d-02d-datasheet-48496454.pdf?src-supplier=Avnet; Supplier Part Number 1: 556-AT24C02D-MAHM-T
U23 = TXB0302DQMR: 2-BIT Bidirectional Voltage-level Translator 8-X2SON -40 to 85; Manufacturer: Texas Instruments; Data Rate: 100Mbps; Nominal Supply Current: 5uA; Number of Channels: 2; Propagation Delay: 5.8ns; Max Supply Voltage: 3.6V; Min Supply Voltage: 900mV; Number of Circuits: 1; High Level Output Current: -20uA; Low Level Output Current: 20uA; Quiescent Current: 10uA; Supplier 1: Digi-Key; Manufacturer Part Number: TXB0302DQMR; RoHS: Yes; Category: Voltage Level Shifters; Stock 1: 19543; Pricing 1: 1=0.81000, 10=0.71000, 25=0.66720, 100=0.54440, 250=0.50568, 500=0.43036, 1000=0.34429 (USD); Mount: Surface Mount; Number of Pins: 8; Contact Plating: Gold; Min Operating Temperature: -40°C; Max Operating Temperature: 85°C; Packaging: Tape and Reel; Package Quantity: 3000; Channel Type: Bidirectional; Logic Function: Translator; Number of Bits: 2; Number of Inputs: 2; Series: -; Supply Current: 5uA; Radiation Hardening: No; Reach SVHC Compliant: Yes; Lead Free: Lead Free; RoHS Compliant: Yes; ComponentLink1URL: https://datasheet.ciiva.com/3171/txb0302-3171542.pdf?src-supplier=Avnet; ComponentLink1Description: https://datasheet.ciiva.com/3171/txb0302-3171542.pdf?src-supplier=Avnet; ComponentLink2URL: https://datasheet.ciiva.com/15096/getdatasheetpartid-664533-15096459.pdf?src-supplier=Verical; ComponentLink2Description: https://datasheet.ciiva.com/15096/getdatasheetpartid-664533-15096459.pdf?src-supplier=Verical; ComponentLink3URL: https://datasheet.ciiva.com/29616/txb0302-29616007.pdf?src-supplier=Digi-Key; ComponentLink3Description: https://datasheet.ciiva.com/29616/txb0302-29616007.pdf?src-supplier=Digi-Key; ComponentLink4URL: https://datasheet.ciiva.com/29616/txb0302-29616006.pdf?src-supplier=Digi-Key; ComponentLink4Description: https://datasheet.ciiva.com/29616/txb0302-29616006.pdf?src-supplier=Digi-Key; ComponentLink5URL: https://datasheet.ciiva.com/29616/txb0302-29616008.pdf?src-supplier=Digi-Key; ComponentLink5Description: https://datasheet.ciiva.com/29616/txb0302-29616008.pdf?src-supplier=Digi-Key; Supplier Part Number 1: 296-36871-1-ND

## Sheet Power_Circuit.SchDoc
size A2; SheetNumber: 15; SheetTotal: 16
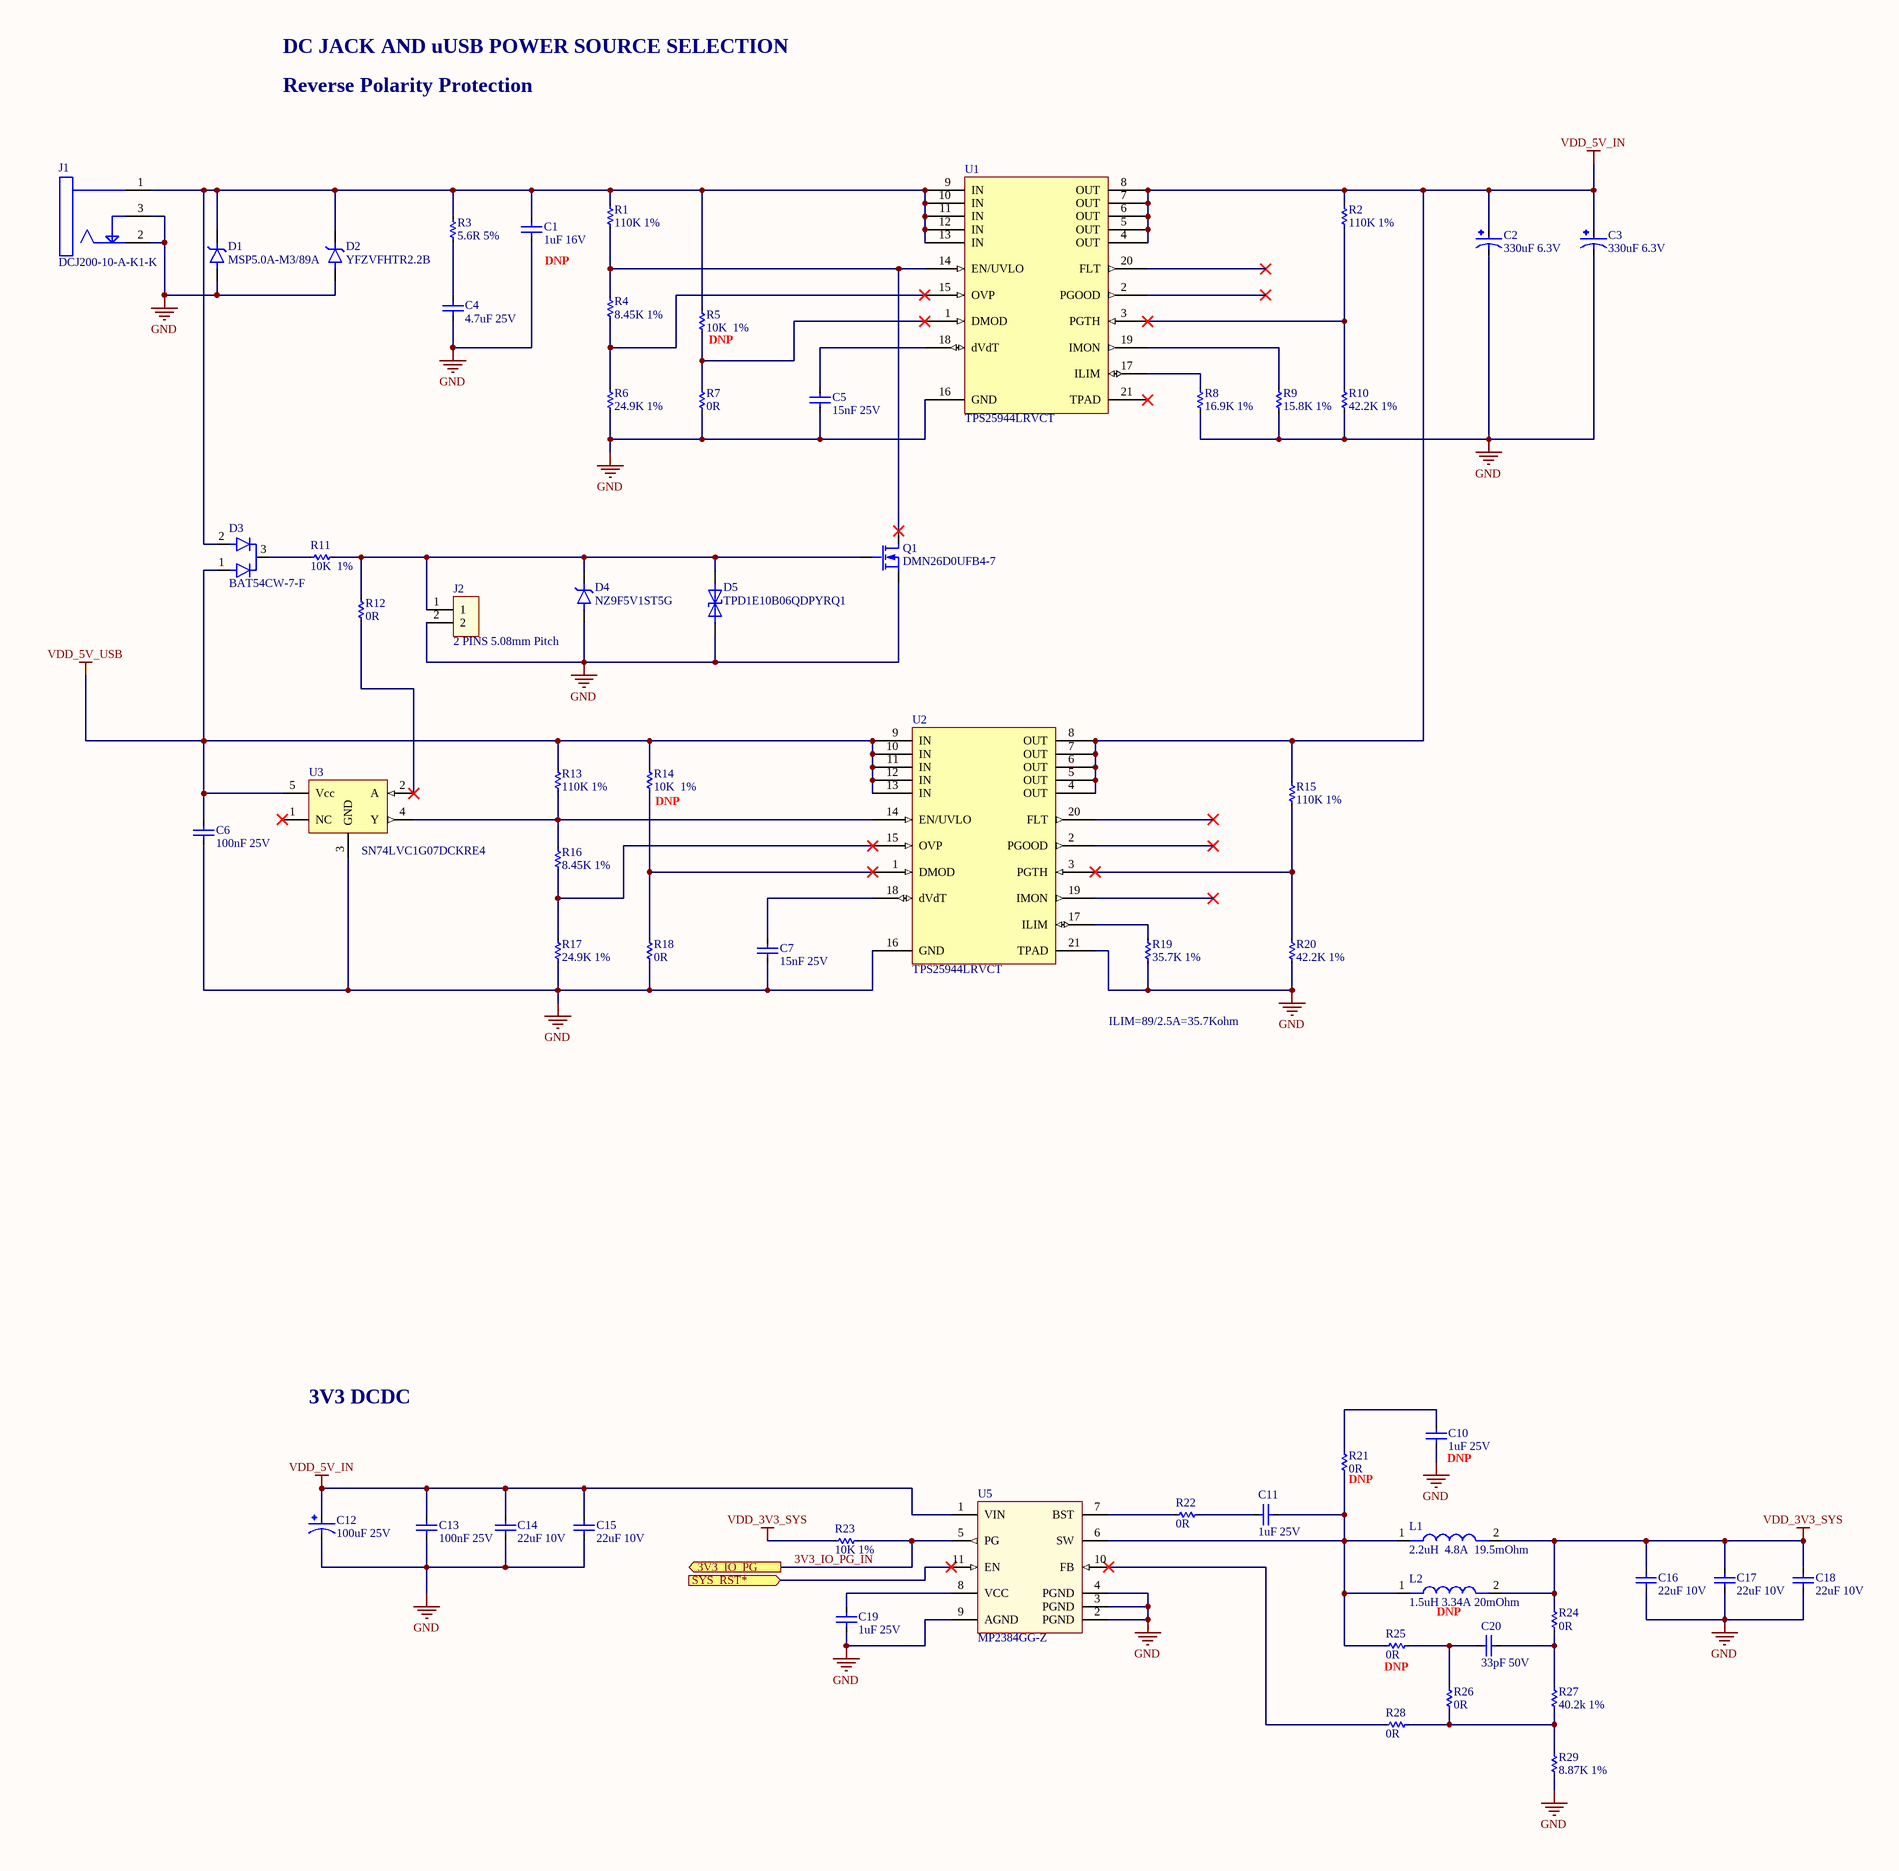
[diagram p13: Power_Circuit.SchDoc, left]
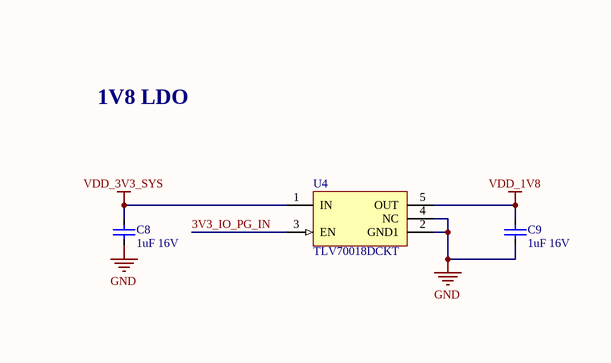
[diagram p14: Power_Circuit.SchDoc, right]

### Parts
C1  1uF 16V  [C0603]
C2  330uF 6.3V  [CP_ELEC_6.3x7.7]
C3  330uF 6.3V  [CP_ELEC_6.3x7.7]
C4  4.7uF 25V  [C0603]
C5  15nF 25V  [C0805]
C6  100nF 25V  [C0402]
C7  15nF 25V  [C0805]
C8  1uF 16V  [C0603]
C9  1uF 16V  [C0603]
C10  1uF 25V  [C0603]
C11  1uF 25V  [C0603]
C12  100uF 25V  [C2917_Tantalum]
C13  100nF 25V  [C0402]
C14  22uF 10V  [C0805]
C15  22uF 10V  [C0805]
C16  22uF 10V  [C0805]
C17  22uF 10V  [C0805]
C18  22uF 10V  [C0805]
C19  1uF 25V  [C0603]
C20  33pF 50V  [C0402]
D1  MSP5.0A-M3/89A  [DO-219AD]
D2  YFZVFHTR2.2B  [YFZVFHTR22B]
D3  BAT54CW-7-F  [SOT-323]
D4  NZ9F5V1ST5G  [SOD-923]
D5  TPD1E10B06QDPYRQ1  [2-X1SON (1x.60)]
J1  DCJ200-10-A-K1-K  [DCJ200-10-A-K1-K]
J2  2 PINS 5.08mm Pitch  [0395443002]
L1  2.2uH  4.8A  19.5mOhm  [NRS8030T2R2NJGJ]
L2  1.5uH 3.34A 20mOhm  [ASPI-4030S-1R5N-T]
Q1  DMN26D0UFB4-7  [DFN1006-3]
R1  110K 1%  [R0402]
R2  110K 1%  [R0402]
R3  5.6R 5%  [R0402]
R4  8.45K 1%  [R0402]
R5  10K  1%  [R0402]
R6  24.9K 1%  [R0402]
R7  0R  [R0603]
R8  16.9K 1%  [R0402]
R9  15.8K 1%  [R0603]
R10  42.2K 1%  [R0402]
R11  10K  1%  [R0402]
R12  0R  [R0603]
R13  110K 1%  [R0402]
R14  10K  1%  [R0402]
R15  110K 1%  [R0402]
R16  8.45K 1%  [R0402]
R17  24.9K 1%  [R0402]
R18  0R  [R0603]
R19  35.7K 1%  [R0402]
R20  42.2K 1%  [R0402]
R21  0R  [R0603]
R22  0R  [R0603]
R23  10K 1%  [R0603]
R24  0R  [R0603]
R25  0R  [R0603]
R26  0R  [R0603]
R27  40.2k 1%  [R0402]
R28  0R  [R0603]
R29  8.87K 1%  [R0402]
U1  TPS25944LRVCT  [WQFN (3x4)-20]
U2  TPS25944LRVCT  [WQFN (3x4)-20]
U3  SN74LVC1G07DCKRE4  [SC70-5]
U4  TLV70018DCKT  [SC70-5]
U5  MP2384GG-Z  [QFN(2X2)-11]

### Ports
3V3_IO_PG (out), SYS_RST* (in)

### Nets
GND: C1.1 C2.2(-) C3.2(-) C4.1 C5.1 C6.1 C7.1 C8.1 C9.1 C10.2 C12.2(-) C13.2 C14.1 C15.1 C16.1 C17.1 C18.1 C19.1 D1.1(A) D2.2(A) D4.2(A) D5.1 J1.2 J1.3 J2.2 Q1.2(S) R6.1 R7.1 R8.1 R9.1 R10.1 R17.1 R18.1 R19.1 R20.1 R29.1 U1.16(GND) U2.16(GND) U2.21(TPAD) U3.3(GND) U4.2(GND1) U4.4(NC) U5.2(PGND) U5.3(PGND) U5.4(PGND) U5.9(AGND)
VDD_1V8: C9.2 U4.5(OUT)
VDD_3V3_SYS: C8.2 C16.2 C17.2 C18.2 L1.2 L2.2 R23.1 R24.1 U4.1(IN)
VDD_5V_IN: C2.1(+1) C3.1(+1) C12.1(+1) C13.1 C14.2 C15.2 R2.2 R15.2 U1.4(OUT) U1.5(OUT) U1.6(OUT) U1.7(OUT) U1.8(OUT) U2.4(OUT) U2.5(OUT) U2.6(OUT) U2.7(OUT) U2.8(OUT) U5.1(VIN)
VDD_5V_USB: C6.2 D3.1 R13.2 R14.2 U2.9(IN) U2.10(IN) U2.11(IN) U2.12(IN) U2.13(IN) U3.5(Vcc)
3V3_IO_PG_IN: R23.2 U4.3(EN) U5.5(PG) ; port 3V3_IO_PG  [project net 3V3_IO_PG]
SYS_RST*: U5.11(EN) ; port SYS_RST*
NetC1_2: C1.2 D1.2(C) D2.1(K) D3.2 J1.1 R1.2 R3.2 R5.2 U1.9(IN) U1.10(IN) U1.11(IN) U1.12(IN) U1.13(IN)
NetC4_2: C4.2 R3.1
NetC5_2: C5.2 U1.18(dVdT)
NetC7_2: C7.2 U2.18(dVdT)
NetC10_1: C10.1 R21.1
NetC11_1: C11.1 R22.1
NetC11_2: C11.2 L1.1 L2.1 R21.2 R25.2 U5.6(SW)
NetC19_2: C19.2 U5.8(VCC)
NetC20_1: C20.1 R25.1 R26.1
NetC20_2: C20.2 R24.2 R27.2
NetD3_3: D3.3 R11.2
NetD4_1: D4.1(K) D5.2 J2.1 Q1.1(G) R11.1 R12.2
NetQ1_3: Q1.3(D) R1.1 R4.2 U1.14(EN/UVLO)
NetR2_1: R2.1 R10.2 U1.3(PGTH)
NetR4_1: R4.1 R6.2 U1.15(OVP)
NetR5_1: R5.1 R7.2 U1.1(DMOD)
NetR8_2: R8.2 U1.17(ILIM)
NetR9_2: R9.2 U1.19(IMON)
NetR12_1: R12.1 U3.2(A)
NetR13_1: R13.1 R16.2 U2.14(EN/UVLO) U3.4(Y)
NetR14_1: R14.1 R18.2 U2.1(DMOD)
NetR15_1: R15.1 R20.2 U2.3(PGTH)
NetR16_1: R16.1 R17.2 U2.15(OVP)
NetR19_2: R19.2 U2.17(ILIM)
NetR22_2: R22.2 U5.7(BST)
NetR26_2: R26.2 R27.1 R28.2 R29.2
NetR28_1: R28.1 U5.10(FB)

Not connected (* = marked no-connect by the designer): U1 2(PGOOD)* 20(FLT)* 21(TPAD)*; U2 2(PGOOD)* 19(IMON)* 20(FLT)*; U3 1(NC)*

### Notes on the sheet
- DC JACK AND uUSB POWER SOURCE SELECTION
- Reverse Polarity Protection
- (near C1) DNP
- 1V8 LDO
- (near R5) DNP
- (near R14) DNP
- ILIM=89/2.5A=35.7Kohm
- 3V3 DCDC
- (near R21) DNP
- (near C10) DNP
- (near L2) DNP
- (near R25) DNP